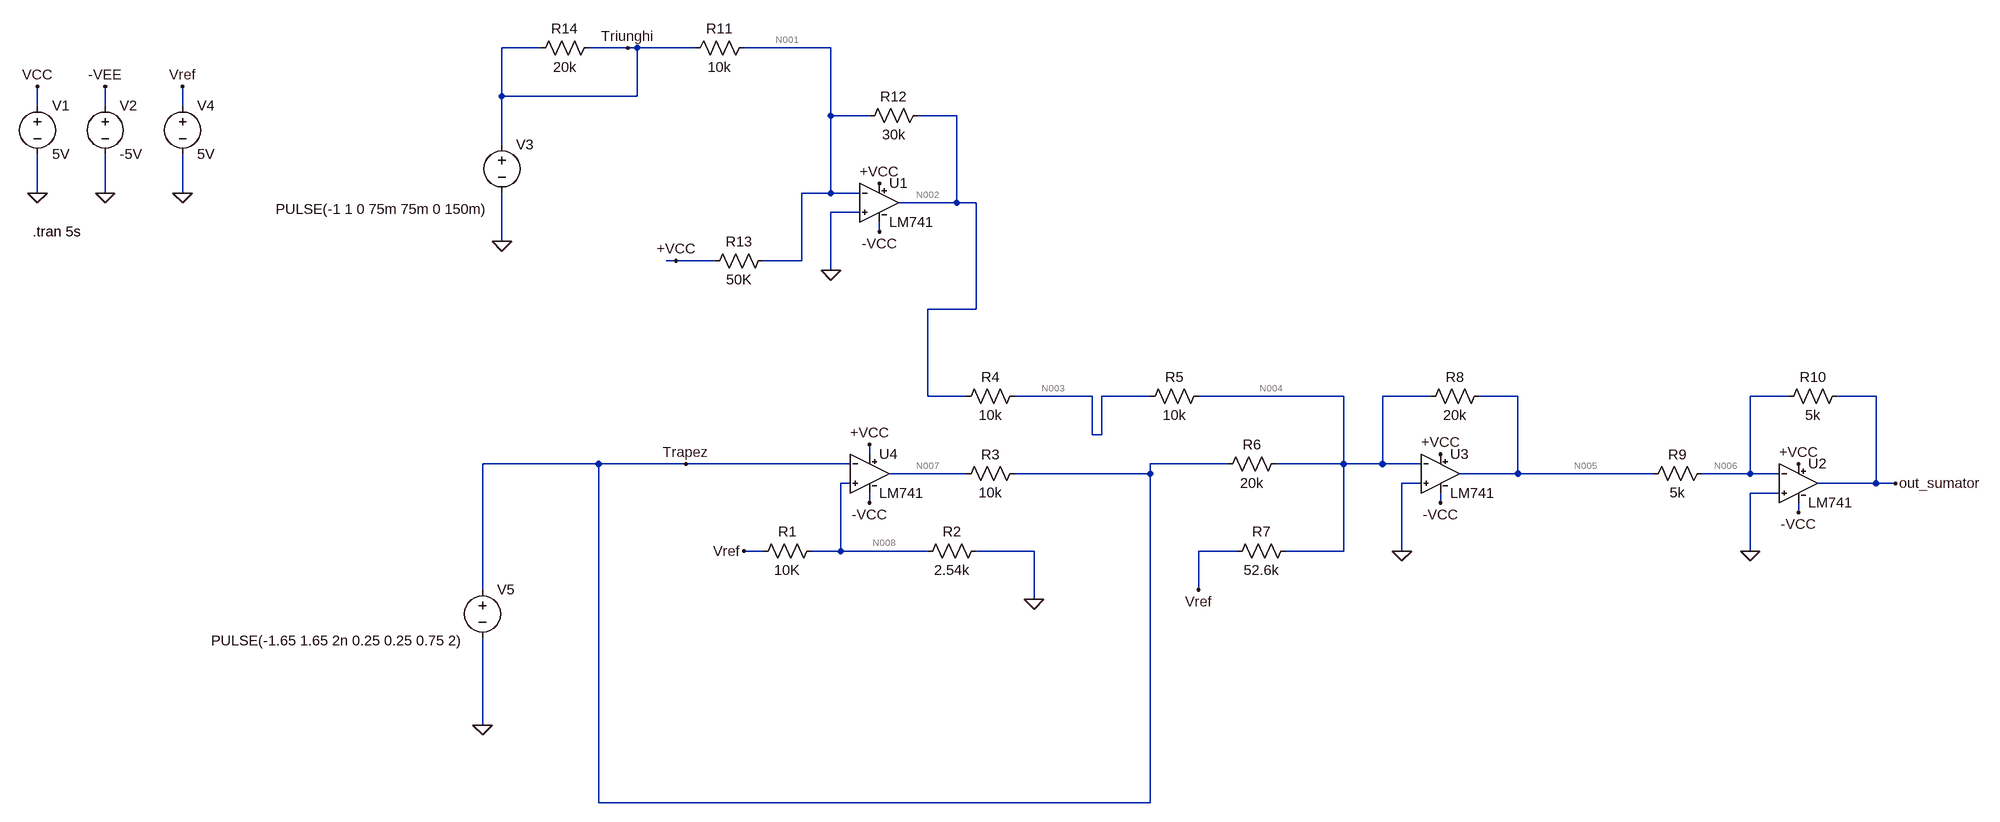
[diagram p0: schematic Sumatobun.asc]
Sumatobun.asc, the LTspice schematic file:
Version 4.1
SHEET 1 3160 1276
WIRE 752 -32 688 -32
WIRE 896 -32 832 -32
WIRE 912 -32 896 -32
WIRE 1008 -32 912 -32
WIRE 1232 -32 1088 -32
WIRE 688 48 688 -32
WIRE 912 48 912 -32
WIRE 912 48 688 48
WIRE -80 64 -80 32
WIRE 32 64 32 32
WIRE 160 64 160 32
WIRE 1232 80 1232 -32
WIRE 1296 80 1232 80
WIRE 1440 80 1376 80
WIRE 688 128 688 48
WIRE -80 208 -80 144
WIRE 32 208 32 144
WIRE 160 208 160 144
WIRE 1232 208 1232 80
WIRE 1232 208 1184 208
WIRE 1280 208 1232 208
WIRE 1440 224 1440 80
WIRE 1440 224 1344 224
WIRE 1472 224 1440 224
WIRE 1280 240 1232 240
WIRE 1312 272 1312 256
WIRE 688 288 688 208
WIRE 976 320 960 320
WIRE 1040 320 976 320
WIRE 1184 320 1184 208
WIRE 1184 320 1120 320
WIRE 1232 336 1232 240
WIRE 1472 400 1472 224
WIRE 1472 400 1392 400
WIRE 1392 544 1392 400
WIRE 1456 544 1392 544
WIRE 1664 544 1536 544
WIRE 1760 544 1680 544
WIRE 2080 544 1840 544
WIRE 2224 544 2144 544
WIRE 2368 544 2304 544
WIRE 2816 544 2752 544
WIRE 2960 544 2896 544
WIRE 1664 608 1664 544
WIRE 1680 608 1680 544
WIRE 1680 608 1664 608
WIRE 1296 640 1296 624
WIRE 848 656 656 656
WIRE 992 656 848 656
WIRE 1264 656 992 656
WIRE 1888 656 1760 656
WIRE 2080 656 2080 544
WIRE 2080 656 1968 656
WIRE 2144 656 2144 544
WIRE 2144 656 2080 656
WIRE 2208 656 2144 656
WIRE 1456 672 1328 672
WIRE 1760 672 1760 656
WIRE 1760 672 1536 672
WIRE 2368 672 2368 544
WIRE 2368 672 2272 672
WIRE 2592 672 2368 672
WIRE 2752 672 2752 544
WIRE 2752 672 2672 672
WIRE 2800 672 2752 672
WIRE 1264 688 1248 688
WIRE 2208 688 2176 688
WIRE 2960 688 2960 544
WIRE 2960 688 2864 688
WIRE 2992 688 2960 688
WIRE 2800 704 2752 704
WIRE 1296 720 1296 704
WIRE 2240 720 2240 704
WIRE 2832 736 2832 720
WIRE 1120 800 1088 800
WIRE 1248 800 1248 688
WIRE 1248 800 1200 800
WIRE 1392 800 1248 800
WIRE 1568 800 1472 800
WIRE 1904 800 1840 800
WIRE 2080 800 2080 656
WIRE 2080 800 1984 800
WIRE 2176 800 2176 688
WIRE 2752 800 2752 704
WIRE 656 864 656 656
WIRE 1840 864 1840 800
WIRE 1568 880 1568 800
WIRE 656 1088 656 944
WIRE 848 1216 848 656
WIRE 1760 1216 1760 672
WIRE 1760 1216 848 1216
FLAG -80 208 0
FLAG 32 208 0
FLAG -80 32 VCC
FLAG 32 32 -VEE
FLAG 1568 880 0
FLAG 1296 624 +VCC
FLAG 1296 720 -VCC
FLAG 2176 800 0
FLAG 2752 800 0
FLAG 2240 720 -VCC
FLAG 2240 640 +VCC
FLAG 2832 656 +VCC
FLAG 2832 736 -VCC
FLAG 1088 800 Vref
FLAG 992 656 Trapez
FLAG 2992 688 out_sumator
FLAG 1232 336 0
FLAG 1312 192 +VCC
FLAG 1312 272 -VCC
FLAG 976 320 +VCC
FLAG 896 -32 Triunghi
FLAG 1840 864 Vref
FLAG 688 288 0
FLAG 160 208 0
FLAG 160 32 Vref
FLAG 656 1088 0
SYMBOL voltage -80 48 R0
SYMATTR InstName V1
SYMATTR Value 5V
SYMBOL voltage 32 48 R0
SYMATTR InstName V2
SYMATTR Value -5V
SYMBOL res 1216 784 R90
WINDOW 0 0 56 VBottom 2
WINDOW 3 32 56 VTop 2
SYMATTR InstName R1
SYMATTR Value 10K
SYMBOL res 1488 784 R90
WINDOW 0 0 56 VBottom 2
WINDOW 3 32 56 VTop 2
SYMATTR InstName R2
SYMATTR Value 2.54k
SYMBOL res 1552 656 R90
WINDOW 0 0 56 VBottom 2
WINDOW 3 32 56 VTop 2
SYMATTR InstName R3
SYMATTR Value 10k
SYMBOL res 1552 528 R90
WINDOW 0 0 56 VBottom 2
WINDOW 3 32 56 VTop 2
SYMATTR InstName R4
SYMATTR Value 10k
SYMBOL res 1744 560 R270
WINDOW 0 32 56 VTop 2
WINDOW 3 0 56 VBottom 2
SYMATTR InstName R5
SYMATTR Value 10k
SYMBOL res 1872 672 R270
WINDOW 0 32 56 VTop 2
WINDOW 3 0 56 VBottom 2
SYMATTR InstName R6
SYMATTR Value 20k
SYMBOL res 1888 816 R270
WINDOW 0 32 56 VTop 2
WINDOW 3 0 56 VBottom 2
SYMATTR InstName R7
SYMATTR Value 52.6k
SYMBOL res 2320 528 R90
WINDOW 0 0 56 VBottom 2
WINDOW 3 32 56 VTop 2
SYMATTR InstName R8
SYMATTR Value 20k
SYMBOL res 2688 656 R90
WINDOW 0 0 56 VBottom 2
WINDOW 3 32 56 VTop 2
SYMATTR InstName R9
SYMATTR Value 5k
SYMBOL res 2912 528 R90
WINDOW 0 0 56 VBottom 2
WINDOW 3 32 56 VTop 2
SYMATTR InstName R10
SYMATTR Value 5k
SYMBOL res 1104 -48 R90
WINDOW 0 0 56 VBottom 2
WINDOW 3 32 56 VTop 2
SYMATTR InstName R11
SYMATTR Value 10k
SYMBOL res 1392 64 R90
WINDOW 0 0 56 VBottom 2
WINDOW 3 32 56 VTop 2
SYMATTR InstName R12
SYMATTR Value 30k
SYMBOL res 1136 304 R90
WINDOW 0 0 56 VBottom 2
WINDOW 3 32 56 VTop 2
SYMATTR InstName R13
SYMATTR Value 50K
SYMBOL res 848 -48 R90
WINDOW 0 0 56 VBottom 2
WINDOW 3 32 56 VTop 2
SYMATTR InstName R14
SYMATTR Value 20k
SYMBOL LM741 1312 160 R0
SYMATTR InstName U1
SYMBOL LM741 2832 624 R0
SYMATTR InstName U2
SYMBOL LM741 2240 608 R0
SYMATTR InstName U3
SYMBOL LM741 1296 608 R0
SYMATTR InstName U4
SYMBOL voltage 688 112 R0
WINDOW 3 -374 123 Left 2
WINDOW 123 0 0 Left 0
WINDOW 39 0 0 Left 0
SYMATTR InstName V3
SYMATTR Value PULSE(-1 1 0 75m 75m 0 150m)
SYMBOL voltage 160 48 R0
SYMATTR InstName V4
SYMATTR Value 5V
SYMBOL voltage 656 848 R0
WINDOW 3 -449 100 Left 2
WINDOW 123 0 0 Left 0
WINDOW 39 0 0 Left 0
SYMATTR InstName V5
SYMATTR Value PULSE(-1.65 1.65 2n 0.25 0.25 0.75 2)
TEXT -88 272 Left 2 !.tran 5s

The netlist it stands for:
* Sumatobun.asc
V1 VCC 0 5V
V2 -VEE 0 -5V
R1 N008 Vref 10K
R2 0 N008 2.54k
R3 Trapez N007 10k
R4 N003 N002 10k
R5 N003 N004 10k
R6 Trapez N004 20k
R7 Vref N004 52.6k
R8 N005 N004 20k
R9 N006 N005 5k
R10 out_sumator N006 5k
R11 N001 Triunghi 10k
R12 N002 N001 30k
R13 N001 +VCC 50K
R14 Triunghi Triunghi 20k
X§U1 0 N001 +VCC -VCC N002 LM741  ; pins In+ In- V+ V- OUT
X§U2 0 N006 +VCC -VCC out_sumator LM741  ; pins In+ In- V+ V- OUT
X§U3 0 N004 +VCC -VCC N005 LM741  ; pins In+ In- V+ V- OUT
X§U4 N008 Trapez +VCC -VCC N007 LM741  ; pins In+ In- V+ V- OUT
V3 Triunghi 0 PULSE(-1 1 0 75m 75m 0 150m)
V4 Vref 0 5V
V5 Trapez 0 PULSE(-1.65 1.65 2n 0.25 0.25 0.75 2)
.tran 5s
.lib LM741.lib
.backanno
.end

* Results of the author's LTspice run, read from the files saved beside the schematic
* Operating Point, zero values left out:
*   V(+vcc) = 170.1 mV
*   V(-vcc) = -1.644 V
*   V(-vee) = -5 V
*   V(n001) = -779.2 mV
*   V(n002) = -732.6 mV
*   V(n003) = -543.8 mV
*   V(n004) = -355 mV
*   V(n005) = -732.2 mV
*   V(n006) = -730.3 mV
*   V(n007) = -752.2 mV
*   V(n008) = 859.5 mV
*   V(out_sumator) = -735.5 mV
*   V(trapez) = -1.65 V
*   V(triunghi) = -1 V
*   V(vcc) = 5 V
*   V(vref) = 5 V
*   I(R1) = -414 µA
*   I(R10) = -1.051 µA
*   I(R11) = 22.08 µA
*   I(R12) = 1.555 µA
*   I(R13) = -18.99 µA
*   I(R2) = -338.4 µA
*   I(R3) = -89.78 µA
*   I(R4) = 18.88 µA
*   I(R5) = -18.88 µA
*   I(R6) = -64.75 µA
*   I(R7) = 101.8 µA
*   I(R8) = -18.86 µA
*   I(R9) = 389.4 nA
*   I(V3) = 22.08 µA
*   I(V4) = -515.9 µA
*   I(V5) = 159.5 µA
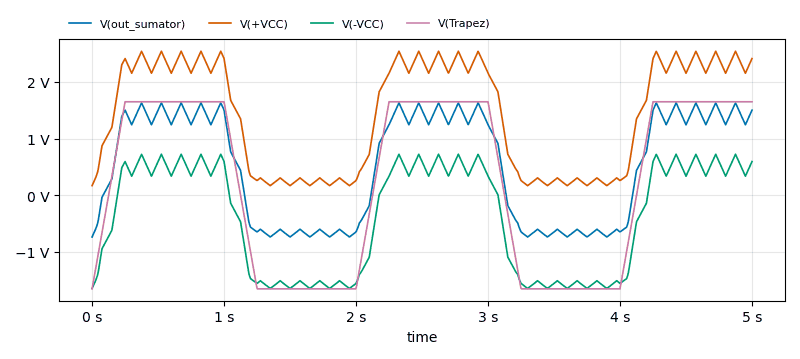
[diagram p1: Transient Analysis of Sumatobun.asc, plotted from the saved traces]
* Transient Analysis, 1 run:
*   V(out_sumator): min -735.5 mV, max 1.632 V, average 514.3 mV, rms 1.094 V, last 1.503 V
*   V(+VCC): min 170.1 mV, max 2.542 V, average 1.422 V, rms 1.72 V, last 2.412 V
*   V(-VCC): min -1.644 V, max 724.4 mV, average -393.2 mV, rms 1.043 V, last 595.2 mV
*   V(Trapez): min -1.65 V, max 1.65 V, average 247.5 mV, rms 1.507 V, last 1.65 V